# Altium project ĐỒ ÁN 1_Project.PrjPcb
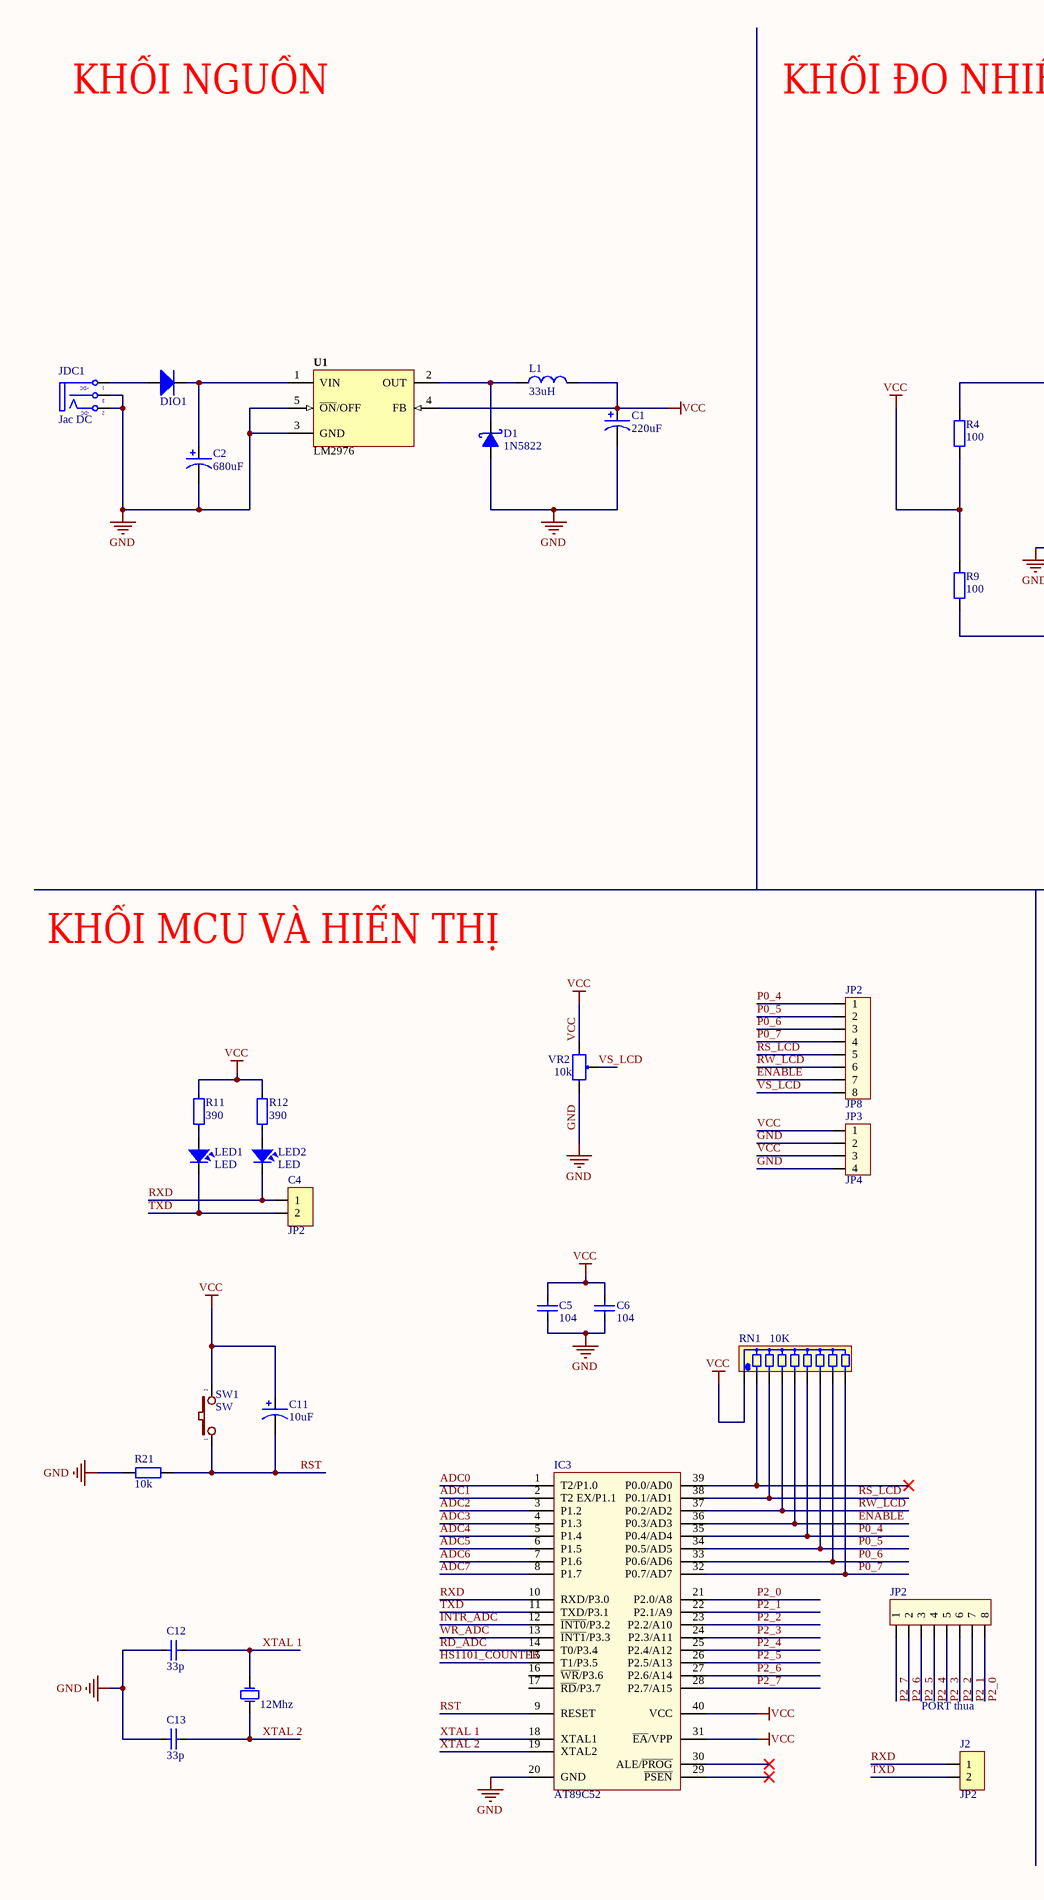
[diagram p0: Schematic_new.schdoc, left]
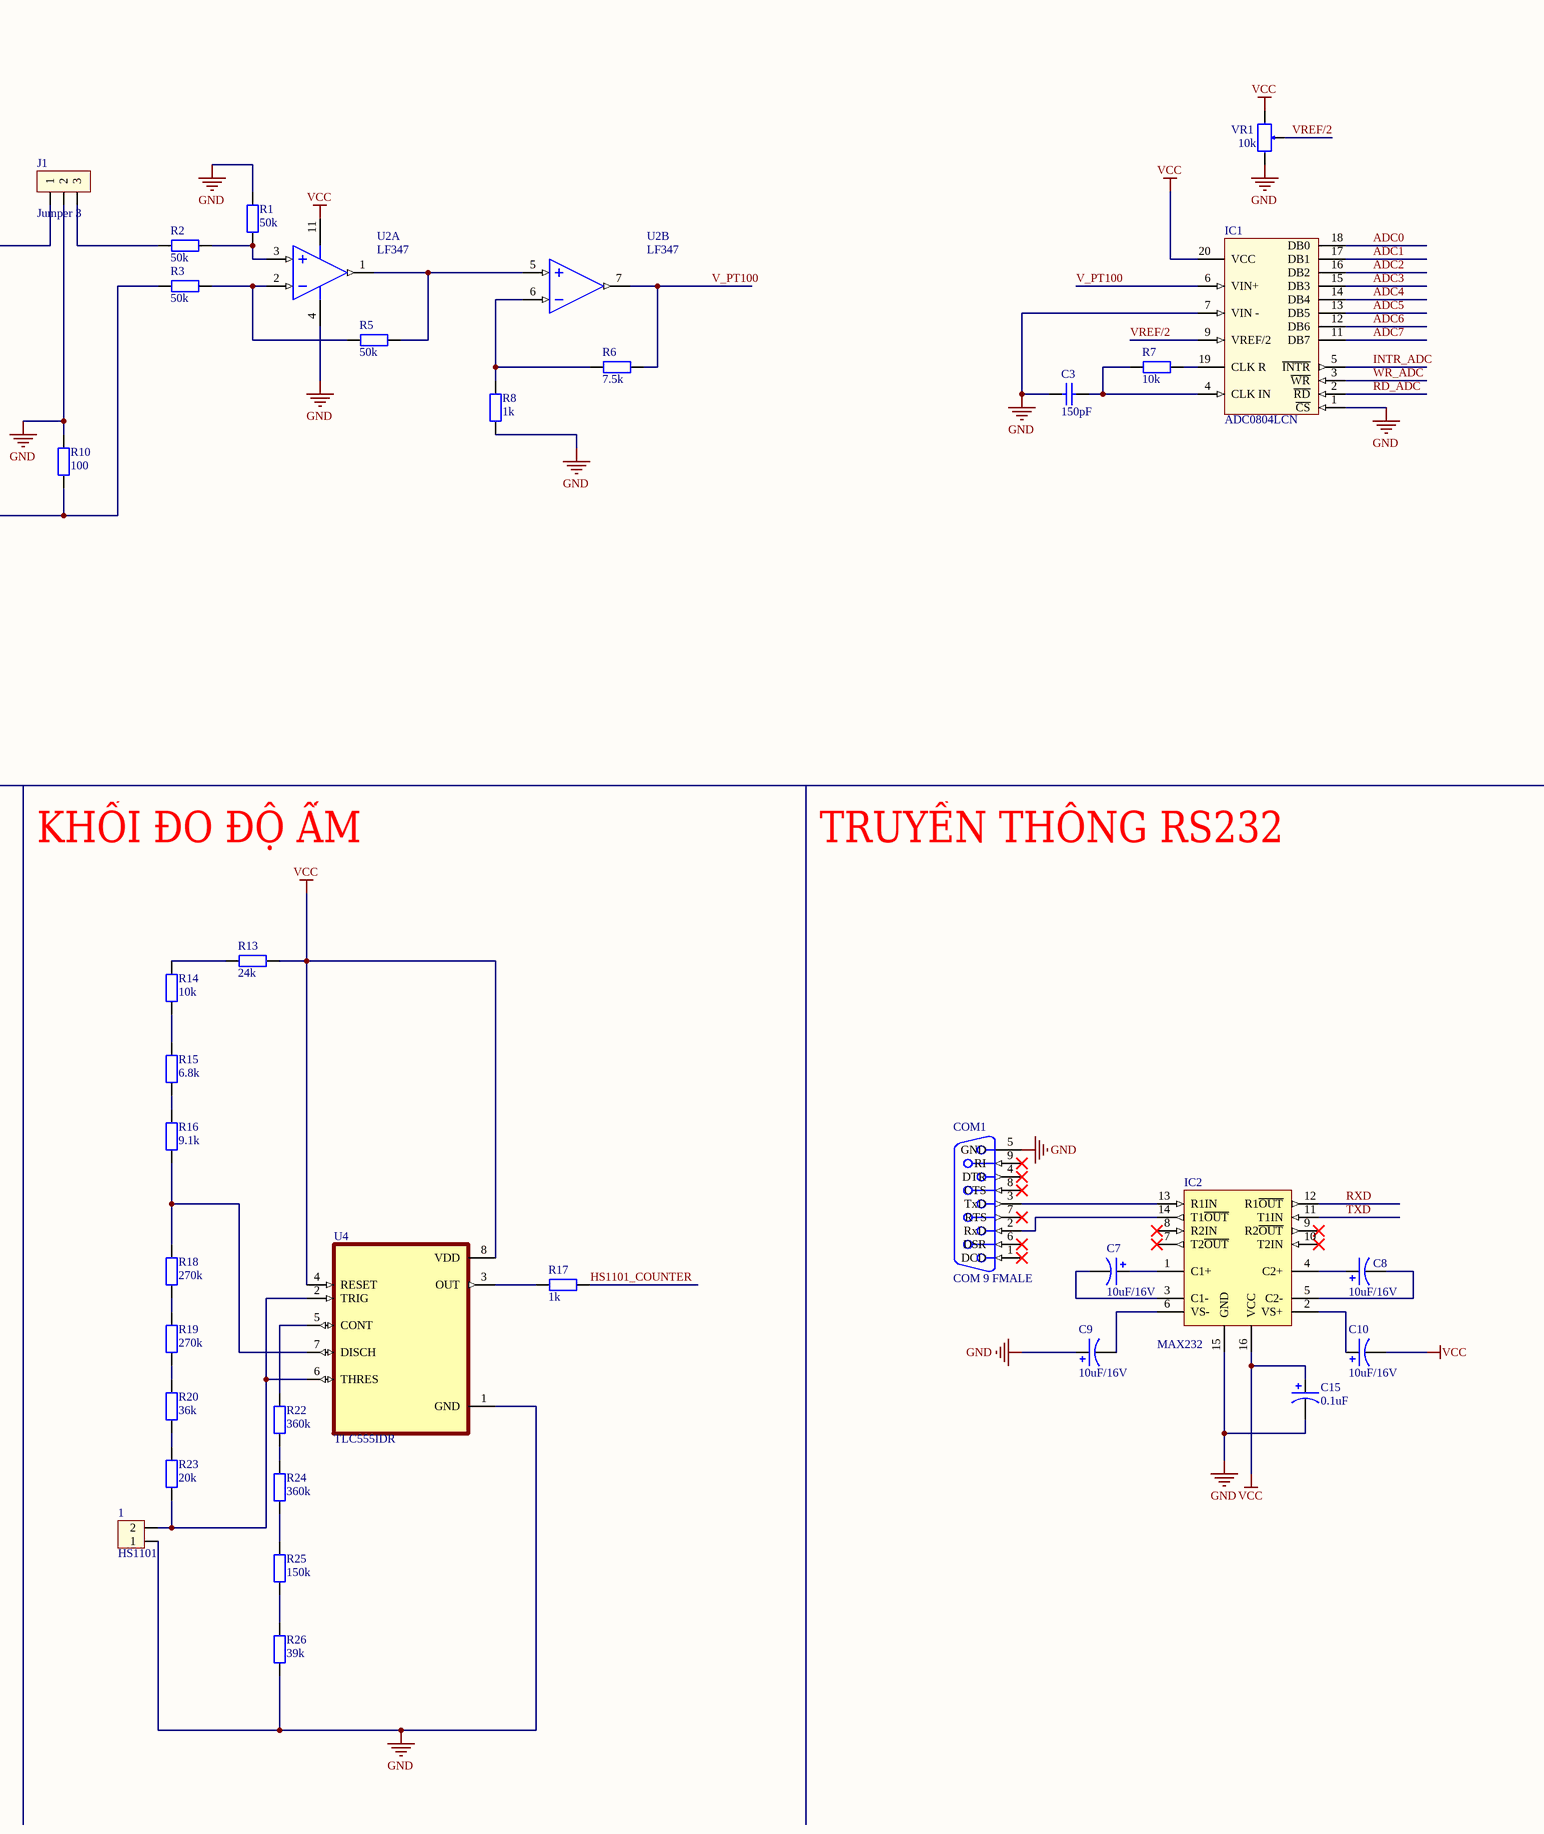
[diagram p1: Schematic_new.schdoc, right]
1 sheet, 64 parts. Net scope: global (net labels, ports and power ports of the same name join across sheets).
Board file: DA1.PcbDoc

## Sheet Schematic_new.schdoc
size C; DocumentNumber: 1; SheetTotal: 1

### Parts
(Parts that share a designator on the sheet are numbered #1, #2 ... from top to bottom, then left to right.)
1  HS1101  [CON2]
C1  220uF  [C3MM]
C2  680uF  [C5mm]
C3  150pF  [CAP_0805]
C4  JP2  [JP2-C1T]
C5  104  [CAP_0805]
C6  104  [CAP_0805]
C7  10uF/16V  [C3MM]
C8  10uF/16V  [C3MM]
C9  10uF/16V  [C3MM]
C10  10uF/16V  [C3MM]
C11  10uF  [C3MM]
C12  33p  [CAP_0805]
C13  33p  [CAP_0805]
C15  0.1uF  [C3MM]
COM1  COM 9 FMALE  [COM9B]
D1  1N5822  [SMA]
DIO1  Diode SMD  [DIO-SMD-106]  (value not drawn)
IC1  ADC0804LCN  [DIP20/W0.3]
IC2  MAX232  [DIP16/W0.3]
IC3  AT89C52  [DIP40/W0.6]
J1  Jumper 3  [JP3]
J2  JP2  [JP2-C1T]
JDC1  Jac DC  [DC-IN]
JP2#1  JP8  [CON8]
JP2#2  (no value)  [CON8]
JP3  JP4  [CON4]
L1  33uH  [L-SMD-M-7.3x4.5]
LED1  LED  [LED-0805-Blue]
LED2  LED  [LED-0805-Green]
R1  50k  [RES-SMD-0805]
R2  50k  [RES-SMD-0805]
R3  50k  [RES-SMD-0805]
R4  100  [RES-SMD-0805]
R5  50k  [RES-SMD-0805]
R6  7.5k  [RES-SMD-0805]
R7  10k  [RES-SMD-0805]
R8  1k  [RES-SMD-0805]
R9  100  [RES-SMD-0805]
R10  100  [RES-SMD-0805]
R11  390  [RES-SMD-0805]
R12  390  [RES-SMD-0805]
R13  24k  [RES-SMD-0805]
R14  10k  [RES-SMD-0805]
R15  6.8k  [RES-SMD-0805]
R16  9.1k  [RES-SMD-0805]
R17  1k  [RES-SMD-0805]
R18  270k  [RES-SMD-0805]
R19  270k  [RES-SMD-0805]
R20  36k  [RES-SMD-0805]
R21  10k  [RES-SMD-0805]
R22  360k  [RES-SMD-0805]
R23  20k  [RES-SMD-0805]
R24  360k  [RES-SMD-0805]
R25  150k  [RES-SMD-0805]
R26  39k  [RES-SMD-0805]
RN1  10K  [RN8]
SW1  SW  [SW2]
U1  LM2976  [TO-263]
U2  LF347  [DIP14/W0.3]  (parts A,B of 4)
U4  TLC555IDR  [SOIC127P599X175-8N]
VR1  10k  [VAR_RESISTOR]
VR2  10k  [VAR_RESISTOR]
Y1  12Mhz  [XTAL]

### Nets
GND: 1.1 C1.2 C2.2 C3.2 C5.1 C6.1 C9.1 C12.2 C13.2 C15.2 COM1.5(GND) D1.1(A) IC1.1(~{CS}) IC1.7(VIN_-) IC1.8(AGND) IC1.10(DGND) IC2.15(GND) IC3.20(GND) J1.2 JDC1.2(TN) JDC1.3(S) JP3.2 JP3.4 R1.2 R8.1 R10.2 R21.1 R26.2 U1.3(GND) U1.5(~{ON}/OFF) U2.4(VCC) U4.1(GND) VR1.3 VR2.3
VCC: C1.1 C5.2 C6.2 C10.2 C11.1 C15.1 IC1.20(VCC) IC2.16(VCC) IC3.31(~{EA}/VPP) IC3.40(VCC) JP3.1 JP3.3 L1.2 R4.1 R9.2 R11.2 R12.2 R13.1 RN1.1 SW1.2 U1.4(FB) U2.11(VEE) U4.4(RESET) U4.8(VDD) VR1.1 VR2.1
ADC0: IC1.18(DB0) IC3.1(T2/P1.0)
ADC1: IC1.17(DB1) IC3.2(T2_EX/P1.1)
ADC2: IC1.16(DB2) IC3.3(P1.2)
ADC3: IC1.15(DB3) IC3.4(P1.3)
ADC4: IC1.14(DB4) IC3.5(P1.4)
ADC5: IC1.13(DB5) IC3.6(P1.5)
ADC6: IC1.12(DB6) IC3.7(P1.6)
ADC7: IC1.11(DB7) IC3.8(P1.7)
ENABLE: IC3.36(P0.3/AD3) JP2#1.7 RN1.5
HS1101_COUNTER: IC3.15(T1/P3.5) R17.2
INTR_ADC: IC1.5(~{INTR}) IC3.12(~{INT0}/P3.2)
P0_4: IC3.35(P0.4/AD4) JP2#1.1 RN1.6
P0_5: IC3.34(P0.5/AD5) JP2#1.2 RN1.7
P0_6: IC3.33(P0.6/AD6) JP2#1.3 RN1.8
P0_7: IC3.32(P0.7/AD7) JP2#1.4 RN1.9
P2_0: IC3.21(P2.0/A8) JP2#2.8
P2_1: IC3.22(P2.1/A9) JP2#2.7
P2_2: IC3.23(P2.2/A10) JP2#2.6
P2_3: IC3.24(P2.3/A11) JP2#2.5
P2_4: IC3.25(P2.4/A12) JP2#2.4
P2_5: IC3.26(P2.5/A13) JP2#2.3
P2_6: IC3.27(P2.6/A14) JP2#2.2
P2_7: IC3.28(P2.7/A15) JP2#2.1
RD_ADC: IC1.2(~{RD}) IC3.14(T0/P3.4)
RS_LCD: IC3.38(P0.1/AD1) JP2#1.5 RN1.3
RST: C11.2 IC3.9(RESET) R21.2 SW1.1
RW_LCD: IC3.37(P0.2/AD2) JP2#1.6 RN1.4
RXD: C4.1 IC2.12(R1~{OUT}) IC3.10(RXD/P3.0) J2.1 LED2.2
TXD: C4.2 IC2.11(T1IN) IC3.11(TXD/P3.1) J2.2 LED1.2
V_PT100: IC1.6(VIN+) R6.1 U2.7(2_OUT)
VREF/2: IC1.9(VREF/2) VR1.2
VS_LCD: JP2#1.8 VR2.2
WR_ADC: IC1.3(~{WR}) IC3.13(~{INT1}/P3.3)
XTAL 1: C12.1 IC3.18(XTAL1) Y1.2(OSC2)
XTAL 2: C13.1 IC3.19(XTAL2) Y1.1(OSC1)
Net1_2: 1.2 R23.2 U4.2(TRIG) U4.6(THRES)
NetC2_1: C2.1 DIO1.2(K) U1.1(VIN)
NetC3_1: C3.1 IC1.4(CLK_IN) R7.1
NetC7_1: C7.1 IC2.1(C1+)
NetC7_2: C7.2 IC2.3(C1-)
NetC8_1: C8.1 IC2.4(C2+)
NetC8_2: C8.2 IC2.5(C2-)
NetC9_2: C9.2 IC2.6(VS-)
NetC10_1: C10.1 IC2.2(VS+)
NetCOM1_2: COM1.2(RxD) IC2.14(T1~{OUT})
NetCOM1_3: COM1.3(TxD) IC2.13(R1IN)
NetD1_2: D1.2(K) L1.1 U1.2(OUT)
NetDIO1_1: DIO1.1(A) JDC1.1(T)
NetIC1_19: IC1.19(CLK_R) R7.2
NetIC3_39: IC3.39(P0.0/AD0) RN1.2
NetJ1_1: J1.1 R4.2
NetJ1_3: J1.3 R2.1
NetLED1_1: LED1.1 R11.1
NetLED2_1: LED2.1 R12.1
NetR1_1: R1.1 R2.2 U2.3(1_IN+)
NetR3_1: R3.1 R9.1 R10.1
NetR3_2: R3.2 R5.1 U2.2(1_IN-)
NetR5_2: R5.2 U2.1(1_OUT) U2.5(2_IN+)
NetR6_2: R6.2 R8.2 U2.6(2_IN-)
NetR13_2: R13.2 R14.1
NetR14_2: R14.2 R15.1
NetR15_2: R15.2 R16.1
NetR16_2: R16.2 R18.1 U4.7(DISCH)
NetR17_1: R17.1 U4.3(OUT)
NetR18_2: R18.2 R19.1
NetR19_2: R19.2 R20.2
NetR20_1: R20.1 R23.1
NetR22_1: R22.1 R24.1
NetR22_2: R22.2 U4.5(CONT)
NetR24_2: R24.2 R25.1
NetR25_2: R25.2 R26.1

Not connected (* = marked no-connect by the designer): COM1 1(DCD)* 4(DTR)* 6(DSR)* 7(RTS)* 8(CTS)* 9(RI)* 10(MH1) 11(MH2); IC2 7(T2~{OUT})* 8(R2IN)* 9(R2~{OUT})* 10(T2IN)*; IC3 16(~{WR}/P3.6) 17(~{RD}/P3.7) 29(~{PSEN})* 30(ALE/~{PROG})*

### Notes on the sheet
- KHỐI NGUỒN
- KHỐI ĐO NHIỆT ĐỘ
- KHỐI MCU VÀ HIỂN THỊ
- KHỐI ĐO ĐỘ ẨM
- TRUYỀN THÔNG RS232
- PORT thua
- (in symbol DCIN) +DC; -DC

### Library data of the parts
1 = Con2: Connector 2; Value: Connector 2
C1 C2 C7-C11 C15 = Cap Pol: Polarized Capacitor (Axial); Published: 8-Jun-2000; LatestRevisionDate: 17-Jul-2002; LatestRevisionNote: Re-released for DXP Platform.; PackageReference: POLAR0.8; Publisher: Altium Limited
C3 = Tu 0805 220nF 50V 10%: Dán; Don_Vi: Con; So_Chan: 2; Ten_Linh_Kien: Tụ 0805 220nF 50V 10%; Ma_Hang: MH008099; Chung_Loai: Dán; Kieu_Chan: *
C4 J2 = JP2: WR-PHD 2.54 mm Angled Socket Header; Manufacturer: W¨¹rth Elektronik eiSos GmbH; partNo: 613002143121; ComponentLink1 Description: Manufacturer; ComponentLink2 Description: Datasheet; NoPins: 02; Created Date: 29 March 2013; ComponentLink1URL: http://www.we-online.com; ComponentLink2URL: http://katalog.we-online.de/em/datasheet/6130xx143121.pdf; Created by: Karrer Zheng
C5 C6 = CapSMD: Capacitor; Value: 33p; Published: 8-Jun-2000; LatestRevisionDate: 17-Jul-2002; LatestRevisionNote: Re-released for DXP Platform.; PackageReference: RAD-0.3; Publisher: Altium Limited
C12 C13 = CapSMD: Capacitor; Published: 8-Jun-2000; LatestRevisionDate: 17-Jul-2002; LatestRevisionNote: Re-released for DXP Platform.; PackageReference: RAD-0.3; Publisher: Altium Limited; Value: 33p
COM1 = COM9F: COM 9; PackageDocument: O; Positions: 9; Gender: Receptacle; Value: COM 9; Published: 15-Jun-2001; LatestRevisionDate: 17-Jul-2002; LatestRevisionNote: Re-released for DXP Platform.; DatasheetDocument: 1-Sep-1999; PackageReference: 788750; Publisher: Altium Limited; Orientation: Right Angle
D1 = 1N5822: Schottky Rectifiers; Value: Diode c?m 1N5408
DIO1 = Diode SMD: Default Diode; Code - JEDEC: DO-214-AB; Value: 1N5007; Published: 8-Jun-2000; Revision: July-2002: Re-released for DXP Platform.; Publisher: Altium Limited
IC1 = ADC0804: Cắm; Ten_Linh_Kien: ADC0804LCN DIP20; Don_Vi: Con; Ma_Hang: MH002626; Ghi_Chu: *; Kieu_Chan: *; Chung_Loai: Cắm
IC2 = MAX232: Dual EIA-232 Driver/Receiver; Value: MAX232
IC3 = AT89C52: Atmel AT89C52, 8k Byte Flash Memory , 40 Pin; Value: AT89C52
J1 = JP3: Value: J3
JDC1 = DCIN: Jac DC input; Value: Jac DC
JP2#1 JP2#2 = Con8: Connector 8; Value: Connector 8
JP3 = Con4: Connector 4; Value: Connector 4
L1 = Inductor: Value: 150 mH
LED1 LED2 = LED: LED Single colour Green and Red; Value: LED 3 ly Single Colour
R1-R6 R8-R10 = Tro 0805 5% 82k: Dán; Don_Vi: Con; So_Chan: 2; Ten_Linh_Kien: Trở 0805 5% 82k; Ma_Hang: MH005329; Chung_Loai: Dán; Kieu_Chan: *
R7 = Tro 0805 5% 10k: Dán; Don_Vi: Con; So_Chan: 2; Ten_Linh_Kien: Trở 0805 5% 10k; Ma_Hang: MH005239; Chung_Loai: Dán; Kieu_Chan: *
R11 R12 = Resistor - SMD: Resistor; Manufacturer: Generic Components; Class: Passive; Published: 08/06/2000; Publisher: Altium Hobart Technology Centre
R13-R16 R18 R19 R21 R23-R26 = Resistor - SMD: Resistor SMD; Manufacturer: Generic Components; Class: Passive; Published: 08/06/2000; Publisher: Altium Hobart Technology Centre
R17 = Tro 0805 1% 1k: Dán; Don_Vi: Con; So_Chan: 2; Ten_Linh_Kien: Trở 0805 1% 1k; Ma_Hang: MH005468; Chung_Loai: Dán; Kieu_Chan: *
R20 = Tro 0805 5% 510k: Dán; Don_Vi: Con; Ma_Hang: MH007566; Ten_Linh_Kien: Trở 0805 5% 510k; So_Chan: 2; Chung_Loai: Dán; Kieu_Chan: *
R22 = Tro 0805 5% 1M: Dán; Don_Vi: Con; So_Chan: 2; Ten_Linh_Kien: Trở 0805 5% 1M; Ma_Hang: MH005235; Chung_Loai: Dán; Kieu_Chan: *
RN1 = RN8: Resistor 8 (Thanh); Value: Tro thanh 10K
SW1 = SW2: Switch button 2 pin; Value: SW chip 2 pin
U1 = LM2596: Max Input Voltage: 12 V; Max Output Current: 3 (6.0 peak) A; Max Output Voltage: mV; Category: IC-Power; Min Input Voltage: mV; Min Output Voltage: mV; Mounting Technology: Surface Mount; Status: Unreleased; Supply Voltage: mV; Temperature Range: -40 to +125 degC
U2 = LF347: Low Power Quad Operational Amplifier; Manufacturer Part Number: LF347BD; Manufacturer: Texas Instruments; Text Field1: pristel=Nsc\nsanopea\<parttype>.ckt; Slew Rate: 13 V/µs; Voltage - Supply, Single/Dual (±): 7 V ~ 36 V, ±3.5 V ~ 18 V; Current - Input Bias: 50pA; Voltage - Input Offset: 3000µV; Number of Circuits: 4; Gain Bandwidth Product: 3MHz; Amplifier Type: J-FET; Current - Supply: 8mA; Supplier 1: Digi-Key; Supplier Part Number 1: 296-7136-5-ND; Package / Case: 14-SOIC (3.9mm Width), 14-SOL; Supplier: Digi-Key; Current - Output / Channel: -; Packaging: Tube; RoHS: RoHS Compliant; Output Type: -; Operating Temperature: 0°C ~ 70°C; Category: Integrated Circuits (ICs); Supplier Part Number: 296-7136-5-ND
U4 = TLC555IDR: 2.1-MHz, 250-A, Low-Power Timer 8-SOIC -40 to 85; MF: Texas Instruments; Purchase-URL: https://pricing.snapeda.com/search/part/TLC555IDR/?ref=eda; MP: TLC555IDR; Package: SOIC-8 Texas Instruments; Value: *; Price: None; SnapEDA_Link: https://www.snapeda.com/parts/TLC555IDR/Texas%20Instruments/view-part/46238/?ref=snap; Availability: Good
VR1 VR2 = VR: Var Resistor; Value: VR 10K
Y1 = XTAL: Crystal Oscillator; Published: 8-Jun-2000; LatestRevisionDate: 17-Jul-2002; LatestRevisionNote: Re-released for DXP Platform.; PackageReference: R38; Publisher: Altium Limited